# Altium project ZEPIC.PrjPcb (part 2 of 2)
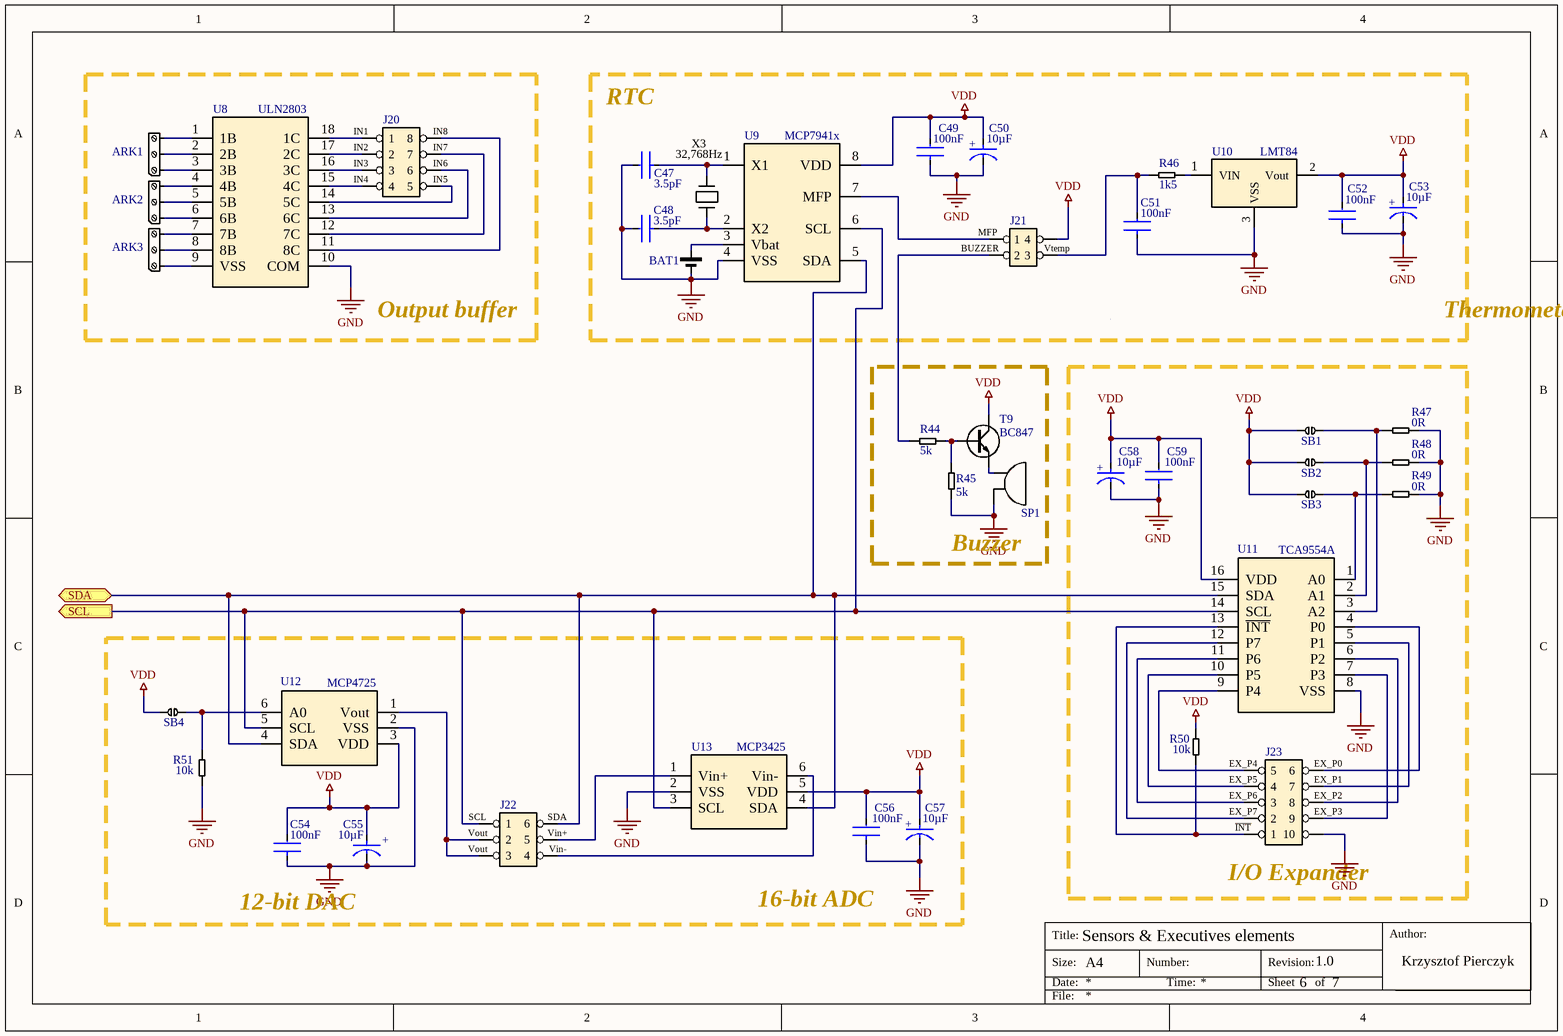
[diagram p7: sensorsAndExecutiveElements.SchDoc]

## Nets that join several sheets
3V3: powerAndCommunication (JP5.3 L2.1), arduinoHeader (C62.2 C63.1 J24.4), portsAndMemory (10 pins)
5V: powerAndCommunication (JP5.1 L1.1 R4.1), arduinoHeader (C60.2 C61.2 J24.5), userInterface (10 pins)
GND: powerAndCommunication (32 pins), core (22 pins), arduinoHeader (10 pins), userInterface (33 pins), portsAndMemory (24 pins), sensorsAndExecutiveElements (27 pins)
VDD: mainSheet (R52.1 R53.1), powerAndCommunication (8 pins), core (16 pins), arduinoHeader (65.1 C64.2 J24.2 J26.6), userInterface (17 pins), portsAndMemory (12 pins), sensorsAndExecutiveElements (22 pins)
~{MCLR}: powerAndCommunication (U7.4), core (5 pins), arduinoHeader (J24.3), portsAndMemory (JP15.1)
RA0: core (J1.17 J3.2 J4.2), portsAndMemory (J8.2 J8.9)
RA1: core (J1.18 J3.3 J4.3), portsAndMemory (J8.3 J8.8)
RA2: core (J1.1 J2.17 J3.4 J4.4), portsAndMemory (J8.4 J8.7)
RA3: core (J1.2 J3.5 J4.5), portsAndMemory (J8.5 J8.6)
RA4: core (6 pins), portsAndMemory (J7.4 J7.7)
RA5: core (J2.2 J3.7 J4.7 JP3.2), portsAndMemory (J7.3 J7.8)
RA6: core (J1.15 J3.14 J4.10 JP3.3), portsAndMemory (J7.2 J7.9)
RA7: core (J1.16 J3.13 J4.9 JP3.4), portsAndMemory (J7.1 J7.10)
RB0: core (J1.6 J3.33 J4.21), portsAndMemory (J10.5 J10.6)
RB1: core (J1.7 J3.34 J4.22), portsAndMemory (J10.4 J10.7)
RB2: core (J1.8 J3.35 J4.23), portsAndMemory (J10.3 J10.8)
RB3: core (J1.9 J3.36 J4.24), portsAndMemory (J10.2 J10.9)
RB4: core (J1.10 J2.13 J3.37 J4.25), portsAndMemory (J9.1 J9.10)
RB5: core (J1.11 J2.12 J3.38 J4.26), portsAndMemory (J9.2 J9.9)
RB6: core (J2.11), portsAndMemory (J9.3 J9.8)
RB7: core (J2.10), portsAndMemory (J9.4 J9.7)
RC0: core (J2.16 J3.15 J4.11 JP2.1), portsAndMemory (J11.1 J11.10)
RC1: core (J2.15 J3.16 J4.12 JP2.2), portsAndMemory (J11.2 J11.9)
RC2: core (J2.14 J3.17 J4.13), portsAndMemory (J11.3 J11.8)
RC3: core (J2.7 J3.18 J4.14), portsAndMemory (J11.4 J11.7)
RC4: core (J2.6 J3.23 J4.15), portsAndMemory (J12.5 J12.6)
RC5: core (J2.5 J3.24 J4.16), portsAndMemory (J12.4 J12.7)
RC6: core (J2.8 J3.25 J4.17), portsAndMemory (J12.3 J12.8)
RC7: core (J2.9 J3.26 J4.18), portsAndMemory (J12.2 J12.9)
RD0: core (J3.19), portsAndMemory (J14.2 J14.9)
RD1: core (J3.20), portsAndMemory (J14.3 J14.8)
RD2: core (J3.21), portsAndMemory (J14.4 J14.7)
RD3: core (J3.22), portsAndMemory (J14.5 J14.6)
RD4: core (J3.27), portsAndMemory (J13.4 J13.7)
RD5: core (J3.28), portsAndMemory (J13.3 J13.8)
RD6: core (J3.29), portsAndMemory (J13.2 J13.9)
RD7: core (J3.30), portsAndMemory (J13.1 J13.10)
RE0: core (J3.8), portsAndMemory (JP15.2 JP15.7)
RE1: core (J3.9), portsAndMemory (JP15.3 JP15.6)
RE2: core (J3.10), portsAndMemory (JP15.4 JP15.5)
SCL: mainSheet (R52.2), powerAndCommunication (U7.10), sensorsAndExecutiveElements (5 pins)
SDA: mainSheet (R53.2), powerAndCommunication (U7.9), sensorsAndExecutiveElements (5 pins)